# EAGLE schematic TD4SMD2 (EAGLE 9.2.2)
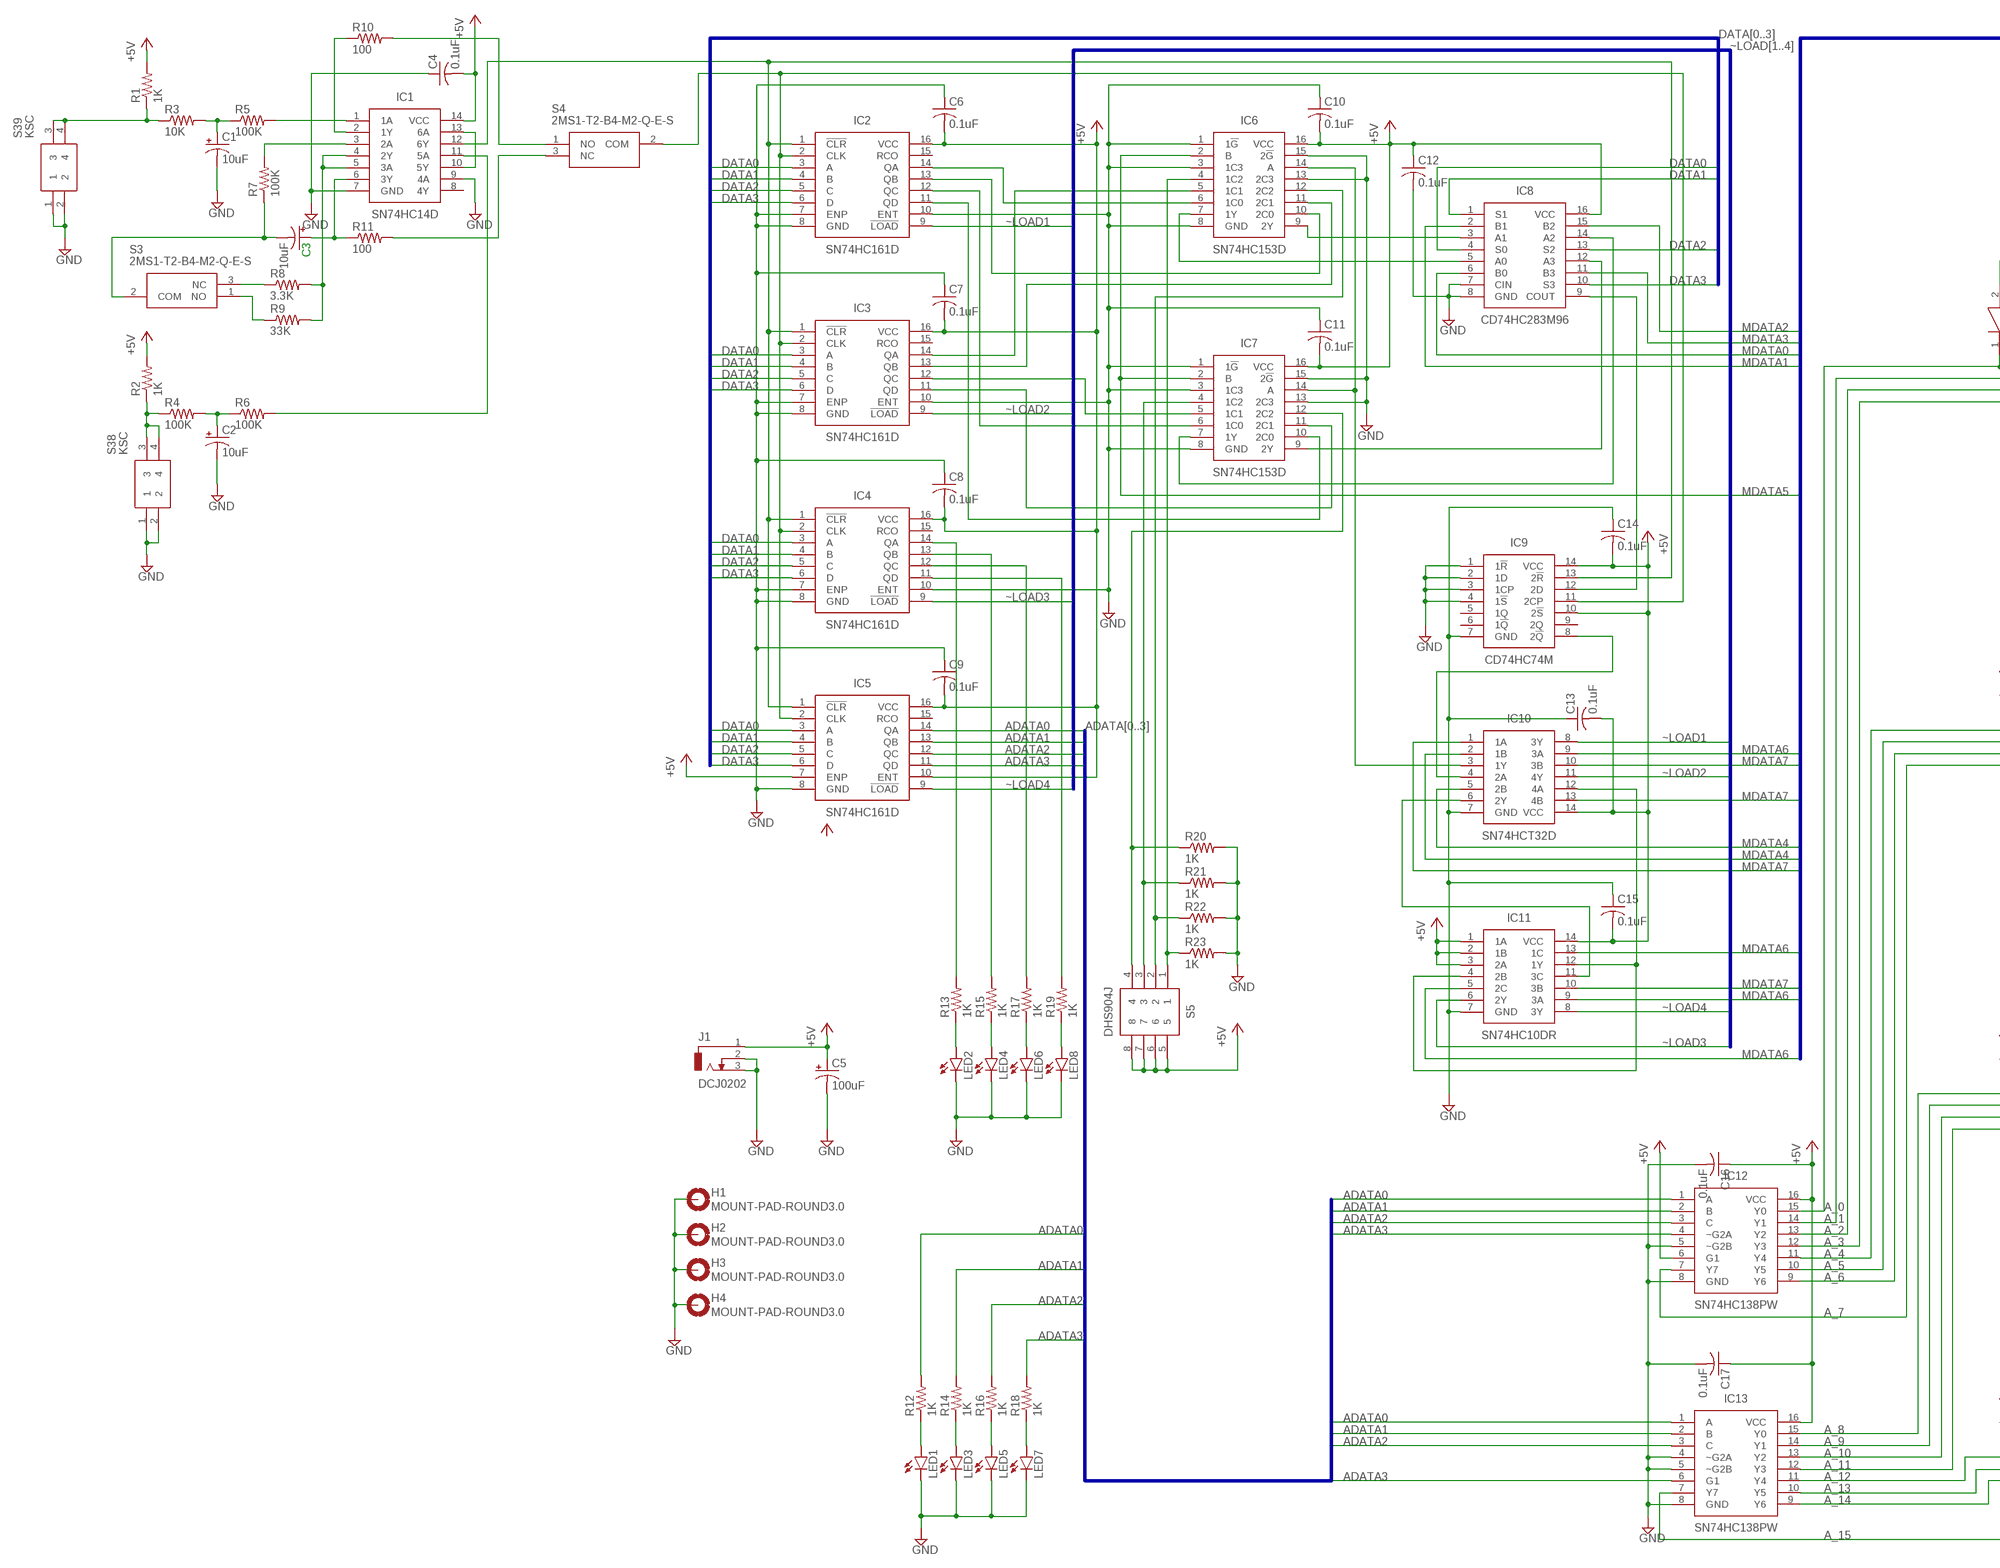
[diagram p0: schematic, sheet 1, part 1 of 2]
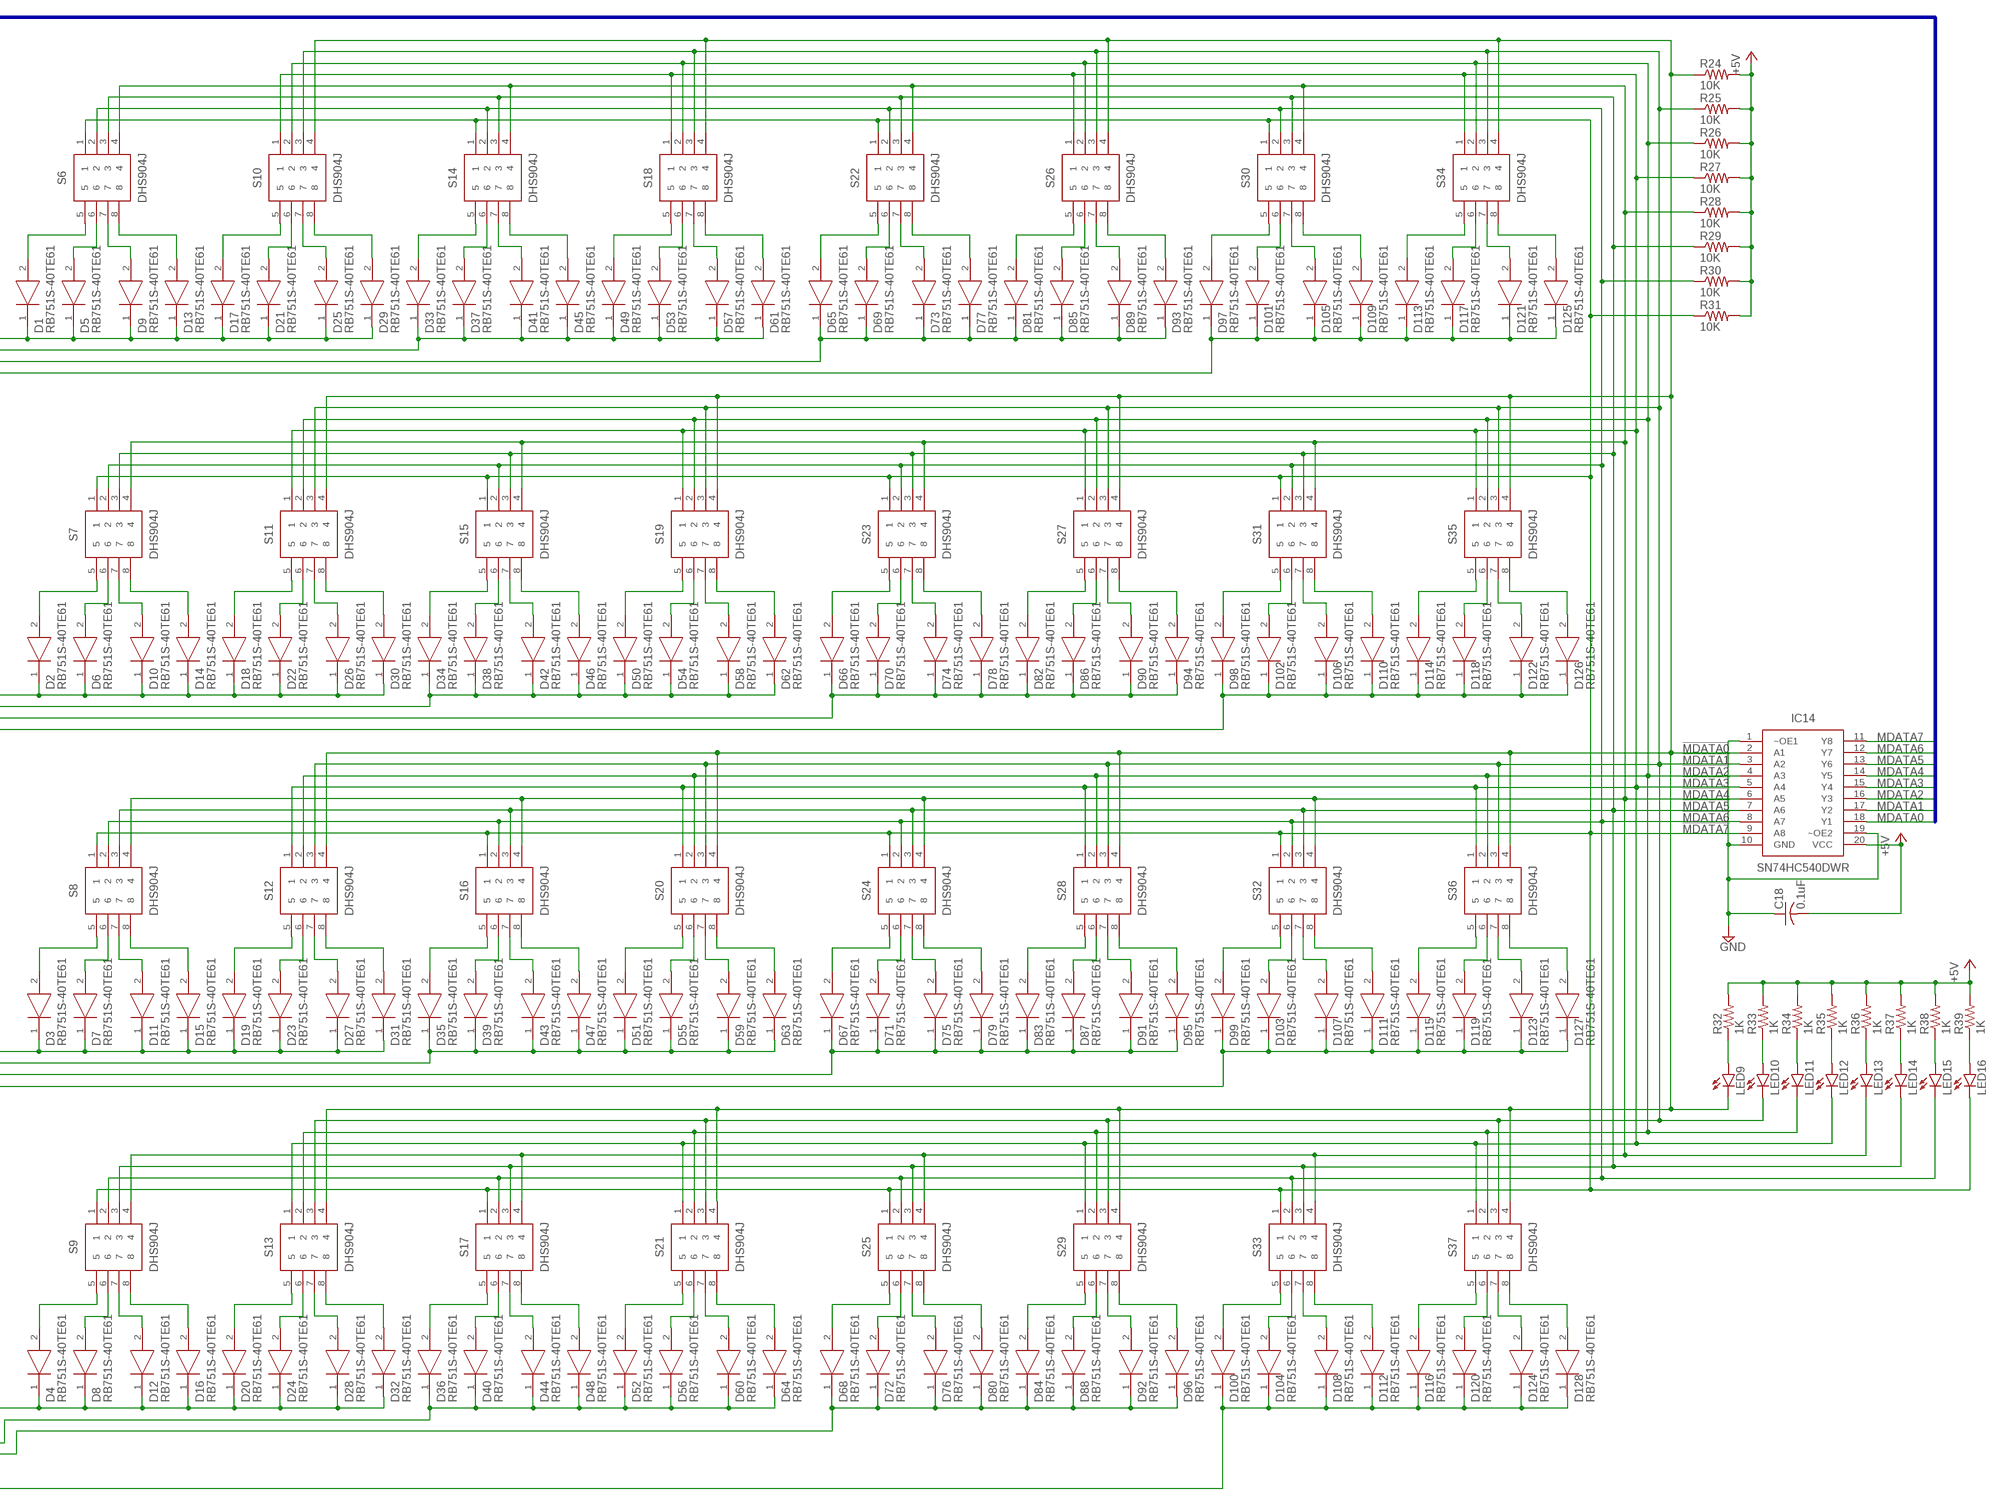
[diagram p1: schematic, sheet 1, part 2 of 2]

## Parts
C1  10uF  CPOL-US153CLV-0405  [153CLV-0405]
C2  10uF  CPOL-US153CLV-0405  [153CLV-0405]
C3  10uF  CPOL-US153CLV-0405  [153CLV-0405]
C4  0.1uF  C-USC0603  [C0603]
C5  100uF  CPOL-US153CLV-1010  [153CLV-1010]
C6  0.1uF  C-USC0603  [C0603]
C7  0.1uF  C-USC0603  [C0603]
C8  0.1uF  C-USC0603  [C0603]
C9  0.1uF  C-USC0603  [C0603]
C10  0.1uF  C-USC0603  [C0603]
C11  0.1uF  C-USC0603  [C0603]
C12  0.1uF  C-USC0603  [C0603]
C13  0.1uF  C-USC0603  [C0603]
C14  0.1uF  C-USC0603  [C0603]
C15  0.1uF  C-USC0603  [C0603]
C16  0.1uF  C-USC0603  [C0603]
C17  0.1uF  C-USC0603  [C0603]
C18  0.1uF  C-USC0603  [C0603]
D1  RB751S-40TE61  [SODFL1608X70N]
D2  RB751S-40TE61  [SODFL1608X70N]
D3  RB751S-40TE61  [SODFL1608X70N]
D4  RB751S-40TE61  [SODFL1608X70N]
D5  RB751S-40TE61  [SODFL1608X70N]
D6  RB751S-40TE61  [SODFL1608X70N]
D7  RB751S-40TE61  [SODFL1608X70N]
D8  RB751S-40TE61  [SODFL1608X70N]
D9  RB751S-40TE61  [SODFL1608X70N]
D10  RB751S-40TE61  [SODFL1608X70N]
D11  RB751S-40TE61  [SODFL1608X70N]
D12  RB751S-40TE61  [SODFL1608X70N]
D13  RB751S-40TE61  [SODFL1608X70N]
D14  RB751S-40TE61  [SODFL1608X70N]
D15  RB751S-40TE61  [SODFL1608X70N]
D16  RB751S-40TE61  [SODFL1608X70N]
D17  RB751S-40TE61  [SODFL1608X70N]
D18  RB751S-40TE61  [SODFL1608X70N]
D19  RB751S-40TE61  [SODFL1608X70N]
D20  RB751S-40TE61  [SODFL1608X70N]
D21  RB751S-40TE61  [SODFL1608X70N]
D22  RB751S-40TE61  [SODFL1608X70N]
D23  RB751S-40TE61  [SODFL1608X70N]
D24  RB751S-40TE61  [SODFL1608X70N]
D25  RB751S-40TE61  [SODFL1608X70N]
D26  RB751S-40TE61  [SODFL1608X70N]
D27  RB751S-40TE61  [SODFL1608X70N]
D28  RB751S-40TE61  [SODFL1608X70N]
D29  RB751S-40TE61  [SODFL1608X70N]
D30  RB751S-40TE61  [SODFL1608X70N]
D31  RB751S-40TE61  [SODFL1608X70N]
D32  RB751S-40TE61  [SODFL1608X70N]
D33  RB751S-40TE61  [SODFL1608X70N]
D34  RB751S-40TE61  [SODFL1608X70N]
D35  RB751S-40TE61  [SODFL1608X70N]
D36  RB751S-40TE61  [SODFL1608X70N]
D37  RB751S-40TE61  [SODFL1608X70N]
D38  RB751S-40TE61  [SODFL1608X70N]
D39  RB751S-40TE61  [SODFL1608X70N]
D40  RB751S-40TE61  [SODFL1608X70N]
D41  RB751S-40TE61  [SODFL1608X70N]
D42  RB751S-40TE61  [SODFL1608X70N]
D43  RB751S-40TE61  [SODFL1608X70N]
D44  RB751S-40TE61  [SODFL1608X70N]
D45  RB751S-40TE61  [SODFL1608X70N]
D46  RB751S-40TE61  [SODFL1608X70N]
D47  RB751S-40TE61  [SODFL1608X70N]
D48  RB751S-40TE61  [SODFL1608X70N]
D49  RB751S-40TE61  [SODFL1608X70N]
D50  RB751S-40TE61  [SODFL1608X70N]
D51  RB751S-40TE61  [SODFL1608X70N]
D52  RB751S-40TE61  [SODFL1608X70N]
D53  RB751S-40TE61  [SODFL1608X70N]
D54  RB751S-40TE61  [SODFL1608X70N]
D55  RB751S-40TE61  [SODFL1608X70N]
D56  RB751S-40TE61  [SODFL1608X70N]
D57  RB751S-40TE61  [SODFL1608X70N]
D58  RB751S-40TE61  [SODFL1608X70N]
D59  RB751S-40TE61  [SODFL1608X70N]
D60  RB751S-40TE61  [SODFL1608X70N]
D61  RB751S-40TE61  [SODFL1608X70N]
D62  RB751S-40TE61  [SODFL1608X70N]
D63  RB751S-40TE61  [SODFL1608X70N]
D64  RB751S-40TE61  [SODFL1608X70N]
D65  RB751S-40TE61  [SODFL1608X70N]
D66  RB751S-40TE61  [SODFL1608X70N]
D67  RB751S-40TE61  [SODFL1608X70N]
D68  RB751S-40TE61  [SODFL1608X70N]
D69  RB751S-40TE61  [SODFL1608X70N]
D70  RB751S-40TE61  [SODFL1608X70N]
D71  RB751S-40TE61  [SODFL1608X70N]
D72  RB751S-40TE61  [SODFL1608X70N]
D73  RB751S-40TE61  [SODFL1608X70N]
D74  RB751S-40TE61  [SODFL1608X70N]
D75  RB751S-40TE61  [SODFL1608X70N]
D76  RB751S-40TE61  [SODFL1608X70N]
D77  RB751S-40TE61  [SODFL1608X70N]
D78  RB751S-40TE61  [SODFL1608X70N]
D79  RB751S-40TE61  [SODFL1608X70N]
D80  RB751S-40TE61  [SODFL1608X70N]
D81  RB751S-40TE61  [SODFL1608X70N]
D82  RB751S-40TE61  [SODFL1608X70N]
D83  RB751S-40TE61  [SODFL1608X70N]
D84  RB751S-40TE61  [SODFL1608X70N]
D85  RB751S-40TE61  [SODFL1608X70N]
D86  RB751S-40TE61  [SODFL1608X70N]
D87  RB751S-40TE61  [SODFL1608X70N]
D88  RB751S-40TE61  [SODFL1608X70N]
D89  RB751S-40TE61  [SODFL1608X70N]
D90  RB751S-40TE61  [SODFL1608X70N]
D91  RB751S-40TE61  [SODFL1608X70N]
D92  RB751S-40TE61  [SODFL1608X70N]
D93  RB751S-40TE61  [SODFL1608X70N]
D94  RB751S-40TE61  [SODFL1608X70N]
D95  RB751S-40TE61  [SODFL1608X70N]
D96  RB751S-40TE61  [SODFL1608X70N]
D97  RB751S-40TE61  [SODFL1608X70N]
D98  RB751S-40TE61  [SODFL1608X70N]
D99  RB751S-40TE61  [SODFL1608X70N]
D100  RB751S-40TE61  [SODFL1608X70N]
D101  RB751S-40TE61  [SODFL1608X70N]
D102  RB751S-40TE61  [SODFL1608X70N]
D103  RB751S-40TE61  [SODFL1608X70N]
D104  RB751S-40TE61  [SODFL1608X70N]
D105  RB751S-40TE61  [SODFL1608X70N]
D106  RB751S-40TE61  [SODFL1608X70N]
D107  RB751S-40TE61  [SODFL1608X70N]
D108  RB751S-40TE61  [SODFL1608X70N]
D109  RB751S-40TE61  [SODFL1608X70N]
D110  RB751S-40TE61  [SODFL1608X70N]
D111  RB751S-40TE61  [SODFL1608X70N]
D112  RB751S-40TE61  [SODFL1608X70N]
D113  RB751S-40TE61  [SODFL1608X70N]
D114  RB751S-40TE61  [SODFL1608X70N]
D115  RB751S-40TE61  [SODFL1608X70N]
D116  RB751S-40TE61  [SODFL1608X70N]
D117  RB751S-40TE61  [SODFL1608X70N]
D118  RB751S-40TE61  [SODFL1608X70N]
D119  RB751S-40TE61  [SODFL1608X70N]
D120  RB751S-40TE61  [SODFL1608X70N]
D121  RB751S-40TE61  [SODFL1608X70N]
D122  RB751S-40TE61  [SODFL1608X70N]
D123  RB751S-40TE61  [SODFL1608X70N]
D124  RB751S-40TE61  [SODFL1608X70N]
D125  RB751S-40TE61  [SODFL1608X70N]
D126  RB751S-40TE61  [SODFL1608X70N]
D127  RB751S-40TE61  [SODFL1608X70N]
D128  RB751S-40TE61  [SODFL1608X70N]
H1  MOUNT-PAD-ROUND3.0  [3,0-PAD]
H2  MOUNT-PAD-ROUND3.0  [3,0-PAD]
H3  MOUNT-PAD-ROUND3.0  [3,0-PAD]
H4  MOUNT-PAD-ROUND3.0  [3,0-PAD]
IC1  SN74HC14D  [SOIC127P600X175-14N]
IC2  SN74HC161D  [SOIC127P600X175-16N]
IC3  SN74HC161D  [SOIC127P600X175-16N]
IC4  SN74HC161D  [SOIC127P600X175-16N]
IC5  SN74HC161D  [SOIC127P600X175-16N]
IC6  SN74HC153D  [SOIC127P600X175-16N]
IC7  SN74HC153D  [SOIC127P600X175-16N]
IC8  CD74HC283M96  [SOIC127P600X175-16N]
IC9  CD74HC74M  [SOIC127P600X175-14N]
IC10  SN74HCT32D  [SOIC127P600X175-14N]
IC11  SN74HC10DR  [SOIC127P600X175-14N]
IC12  SN74HC138PW  [SOP65P640X120-16N]
IC13  SN74HC138PW  [SOP65P640X120-16N]
IC14  SN74HC540DWR  [SOIC127P1030X265-20N]
J1  DCJ0202  [DCJ0202]
LED1  LEDCHIP-LED0603  [CHIP-LED0603]
LED2  LEDCHIP-LED0603  [CHIP-LED0603]
LED3  LEDCHIP-LED0603  [CHIP-LED0603]
LED4  LEDCHIP-LED0603  [CHIP-LED0603]
LED5  LEDCHIP-LED0603  [CHIP-LED0603]
LED6  LEDCHIP-LED0603  [CHIP-LED0603]
LED7  LEDCHIP-LED0603  [CHIP-LED0603]
LED8  LEDCHIP-LED0603  [CHIP-LED0603]
LED9  LEDCHIP-LED0603  [CHIP-LED0603]
LED10  LEDCHIP-LED0603  [CHIP-LED0603]
LED11  LEDCHIP-LED0603  [CHIP-LED0603]
LED12  LEDCHIP-LED0603  [CHIP-LED0603]
LED13  LEDCHIP-LED0603  [CHIP-LED0603]
LED14  LEDCHIP-LED0603  [CHIP-LED0603]
LED15  LEDCHIP-LED0603  [CHIP-LED0603]
LED16  LEDCHIP-LED0603  [CHIP-LED0603]
R1  1K  R-US_R0603  [R0603]
R2  1K  R-US_R0603  [R0603]
R3  10K  R-US_R0603  [R0603]
R4  100K  R-US_R0603  [R0603]
R5  100K  R-US_R0603  [R0603]
R6  100K  R-US_R0603  [R0603]
R7  100K  R-US_R0603  [R0603]
R8  3.3K  R-US_R0603  [R0603]
R9  33K  R-US_R0603  [R0603]
R10  100  R-US_R0603  [R0603]
R11  100  R-US_R0603  [R0603]
R12  1K  R-US_R0603  [R0603]
R13  1K  R-US_R0603  [R0603]
R14  1K  R-US_R0603  [R0603]
R15  1K  R-US_R0603  [R0603]
R16  1K  R-US_R0603  [R0603]
R17  1K  R-US_R0603  [R0603]
R18  1K  R-US_R0603  [R0603]
R19  1K  R-US_R0603  [R0603]
R20  1K  R-US_R0603  [R0603]
R21  1K  R-US_R0603  [R0603]
R22  1K  R-US_R0603  [R0603]
R23  1K  R-US_R0603  [R0603]
R24  10K  R-US_R0603  [R0603]
R25  10K  R-US_R0603  [R0603]
R26  10K  R-US_R0603  [R0603]
R27  10K  R-US_R0603  [R0603]
R28  10K  R-US_R0603  [R0603]
R29  10K  R-US_R0603  [R0603]
R30  10K  R-US_R0603  [R0603]
R31  10K  R-US_R0603  [R0603]
R32  1K  R-US_R0603  [R0603]
R33  1K  R-US_R0603  [R0603]
R34  1K  R-US_R0603  [R0603]
R35  1K  R-US_R0603  [R0603]
R36  1K  R-US_R0603  [R0603]
R37  1K  R-US_R0603  [R0603]
R38  1K  R-US_R0603  [R0603]
R39  1K  R-US_R0603  [R0603]
S3  2MS1-T2-B4-M2-Q-E-S  [2MS1T2B4M2QES]
S4  2MS1-T2-B4-M2-Q-E-S  [2MS1T2B4M2QES]
S5  DHS904J  [DHS904J]
S6  DHS904J  [DHS904J]
S7  DHS904J  [DHS904J]
S8  DHS904J  [DHS904J]
S9  DHS904J  [DHS904J]
S10  DHS904J  [DHS904J]
S11  DHS904J  [DHS904J]
S12  DHS904J  [DHS904J]
S13  DHS904J  [DHS904J]
S14  DHS904J  [DHS904J]
S15  DHS904J  [DHS904J]
S16  DHS904J  [DHS904J]
S17  DHS904J  [DHS904J]
S18  DHS904J  [DHS904J]
S19  DHS904J  [DHS904J]
S20  DHS904J  [DHS904J]
S21  DHS904J  [DHS904J]
S22  DHS904J  [DHS904J]
S23  DHS904J  [DHS904J]
S24  DHS904J  [DHS904J]
S25  DHS904J  [DHS904J]
S26  DHS904J  [DHS904J]
S27  DHS904J  [DHS904J]
S28  DHS904J  [DHS904J]
S29  DHS904J  [DHS904J]
S30  DHS904J  [DHS904J]
S31  DHS904J  [DHS904J]
S32  DHS904J  [DHS904J]
S33  DHS904J  [DHS904J]
S34  DHS904J  [DHS904J]
S35  DHS904J  [DHS904J]
S36  DHS904J  [DHS904J]
S37  DHS904J  [DHS904J]
S38  KSC  [KSC]
S39  KSC  [KSC]

## Nets
!MDATA0: IC14.2(A1) LED9.C R24.1 S10.4 S11.4 S12.4 S13.4 S18.4 S19.4 S20.4 S21.4 S26.4 S27.4 S28.4 S29.4 S34.4 S35.4 S36.4 S37.4
!MDATA1: IC14.3(A2) LED10.C R25.1 S10.3 S11.3 S12.3 S13.3 S18.3 S19.3 S20.3 S21.3 S26.3 S27.3 S28.3 S29.3 S34.3 S35.3 S36.3 S37.3
!MDATA2: IC14.4(A3) LED11.C R26.1 S10.2 S11.2 S12.2 S13.2 S18.2 S19.2 S20.2 S21.2 S26.2 S27.2 S28.2 S29.2 S34.2 S35.2 S36.2 S37.2
!MDATA3: IC14.5(A4) LED12.C R27.1 S10.1 S11.1 S12.1 S13.1 S18.1 S19.1 S20.1 S21.1 S26.1 S27.1 S28.1 S29.1 S34.1 S35.1 S36.1 S37.1
!MDATA4: IC14.6(A5) LED13.C R28.1 S6.4 S7.4 S8.4 S9.4 S14.4 S15.4 S16.4 S17.4 S22.4 S23.4 S24.4 S25.4 S30.4 S31.4 S32.4 S33.4
!MDATA5: IC14.7(A6) LED14.C R29.1 S6.3 S7.3 S8.3 S9.3 S14.3 S15.3 S16.3 S17.3 S22.3 S23.3 S24.3 S25.3 S30.3 S31.3 S32.3 S33.3
!MDATA6: IC14.8(A7) LED15.C R30.1 S6.2 S7.2 S8.2 S9.2 S14.2 S15.2 S16.2 S17.2 S22.2 S23.2 S24.2 S25.2 S30.2 S31.2 S32.2 S33.2
!MDATA7: IC14.9(A8) LED16.C R31.1 S6.1 S7.1 S8.1 S9.1 S14.1 S15.1 S16.1 S17.1 S22.1 S23.1 S24.1 S25.1 S30.1 S31.1 S32.1 S33.1
+5V [Power]: C4.2 C5.+ C6.2 C7.2 C8.2 C9.2 C10.2 C11.2 C12.1 C13.2 C14.2 C15.2 C16.1 C17.1 C18.2 IC1.14(VCC) IC2.16(VCC) IC3.16(VCC) IC4.16(VCC) IC5.7(ENP) IC5.10(ENT) IC5.16(VCC) IC6.16(VCC) IC7.16(VCC) IC8.16(VCC) IC9.10(2!S) IC9.14(VCC) IC10.14(VCC) IC11.1(1A) IC11.2(1B) IC11.3(2A) IC11.14(VCC) IC12.6(G1) IC12.16(VCC) IC13.16(VCC) IC14.20(VCC) J1.1 R1.2 R2.2 R24.2 R25.2 R26.2 R27.2 R28.2 R29.2 R30.2 R31.2 R32.2 R33.2 R34.2 R35.2 R36.2 R37.2 R38.2 R39.2 S5.5 S5.6 S5.7 S5.8
A_0: D1.1(K) D5.1(K) D9.1(K) D13.1(K) D17.1(K) D21.1(K) D25.1(K) D29.1(K) IC12.15(Y0)
A_1: D33.1(K) D37.1(K) D41.1(K) D45.1(K) D49.1(K) D53.1(K) D57.1(K) D61.1(K) IC12.14(Y1)
A_2: D65.1(K) D69.1(K) D73.1(K) D77.1(K) D81.1(K) D85.1(K) D89.1(K) D93.1(K) IC12.13(Y2)
A_3: D97.1(K) D101.1(K) D105.1(K) D109.1(K) D113.1(K) D117.1(K) D121.1(K) D125.1(K) IC12.12(Y3)
A_4: D2.1(K) D6.1(K) D10.1(K) D14.1(K) D18.1(K) D22.1(K) D26.1(K) D30.1(K) IC12.11(Y4)
A_5: D34.1(K) D38.1(K) D42.1(K) D46.1(K) D50.1(K) D54.1(K) D58.1(K) D62.1(K) IC12.10(Y5)
A_6: D66.1(K) D70.1(K) D74.1(K) D78.1(K) D82.1(K) D86.1(K) D90.1(K) D94.1(K) IC12.9(Y6)
A_7: D98.1(K) D102.1(K) D106.1(K) D110.1(K) D114.1(K) D118.1(K) D122.1(K) D126.1(K) IC12.7(Y7)
A_8: D3.1(K) D7.1(K) D11.1(K) D15.1(K) D19.1(K) D23.1(K) D27.1(K) D31.1(K) IC13.15(Y0)
A_9: D35.1(K) D39.1(K) D43.1(K) D47.1(K) D51.1(K) D55.1(K) D59.1(K) D63.1(K) IC13.14(Y1)
A_10: D67.1(K) D71.1(K) D75.1(K) D79.1(K) D83.1(K) D87.1(K) D91.1(K) D95.1(K) IC13.13(Y2)
A_11: D99.1(K) D103.1(K) D107.1(K) D111.1(K) D115.1(K) D119.1(K) D123.1(K) D127.1(K) IC13.12(Y3)
A_12: D4.1(K) D8.1(K) D12.1(K) D16.1(K) D20.1(K) D24.1(K) D28.1(K) D32.1(K) IC13.11(Y4)
A_13: D36.1(K) D40.1(K) D44.1(K) D48.1(K) D52.1(K) D56.1(K) D60.1(K) D64.1(K) IC13.10(Y5)
A_14: D68.1(K) D72.1(K) D76.1(K) D80.1(K) D84.1(K) D88.1(K) D92.1(K) D96.1(K) IC13.9(Y6)
A_15: D100.1(K) D104.1(K) D108.1(K) D112.1(K) D116.1(K) D120.1(K) D124.1(K) D128.1(K) IC13.7(Y7)
ADATA0: IC5.14(QA) IC12.1(A) IC13.1(A) R12.2
ADATA1: IC5.13(QB) IC12.2(B) IC13.2(B) R14.2
ADATA2: IC5.12(QC) IC12.3(C) IC13.3(C) R16.2
ADATA3: IC5.11(QD) IC12.4(~G2A) IC13.6(G1) R18.2
DATA0: IC2.3(A) IC3.3(A) IC4.3(A) IC5.3(A) IC8.4(S0)
DATA1: IC2.4(B) IC3.4(B) IC4.4(B) IC5.4(B) IC8.1(S1)
DATA2: IC2.5(C) IC3.5(C) IC4.5(C) IC5.5(C) IC8.13(S2)
DATA3: IC2.6(D) IC3.6(D) IC4.6(D) IC5.6(D) IC8.10(S3)
GND [Power]: C1.- C2.- C4.1 C5.- C6.1 C7.1 C8.1 C9.1 C10.1 C11.1 C12.2 C13.1 C14.1 C15.1 C16.2 C17.2 C18.1 H1.B3,0(MOUNT) H2.B3,0(MOUNT) H3.B3,0(MOUNT) H4.B3,0(MOUNT) IC1.7(GND) IC1.9(4A) IC2.7(ENP) IC2.8(GND) IC2.10(ENT) IC3.7(ENP) IC3.8(GND) IC3.10(ENT) IC4.7(ENP) IC4.8(GND) IC4.10(ENT) IC5.8(GND) IC6.1(1!G) IC6.3(1C3) IC6.8(GND) IC6.13(2C3) IC6.15(2!G) IC7.1(1!G) IC7.3(1C3) IC7.8(GND) IC7.13(2C3) IC7.15(2!G) IC8.7(CIN) IC8.8(GND) IC9.1(1!R) IC9.2(1D) IC9.3(1CP) IC9.4(1!S) IC9.7(GND) IC10.7(GND) IC11.7(GND) IC12.5(~G2B) IC12.8(GND) IC13.4(~G2A) IC13.5(~G2B) IC13.8(GND) IC14.1(~OE1) IC14.10(GND) IC14.19(~OE2) J1.2 J1.3 LED1.C LED2.C LED3.C LED4.C LED5.C LED6.C LED7.C LED8.C R20.2 R21.2 R22.2 R23.2 S38.1 S38.2 S39.1 S39.2
MDATA0: IC8.6(B0) IC14.18(Y1)
MDATA1: IC8.2(B1) IC14.17(Y2)
MDATA2: IC8.15(B2) IC14.16(Y3)
MDATA3: IC8.11(B3) IC14.15(Y4)
MDATA4: IC10.2(1B) IC10.5(2B) IC14.14(Y5)
MDATA5: IC6.2(B) IC7.2(B) IC14.13(Y6)
MDATA6: IC10.9(3A) IC11.5(2C) IC11.9(3A) IC11.13(1C) IC14.12(Y7)
MDATA7: IC10.1(1A) IC10.10(3B) IC10.13(4B) IC11.10(3B) IC14.11(Y8)
N$1: IC2.14(QA) IC6.6(1C0)
N$2: IC2.13(QB) IC6.10(2C0)
N$3: IC2.12(QC) IC7.6(1C0)
N$4: IC7.7(1Y) IC8.14(A2)
N$5: IC6.4(1C2) R23.1 S5.1
N$6: IC6.12(2C2) R22.1 S5.2
N$7: IC7.4(1C2) R21.1 S5.3
N$8: IC7.12(2C2) R20.1 S5.4
N$9: R1.1 R3.1 S39.3 S39.4
N$10: IC3.14(QA) IC6.5(1C1)
N$11: IC3.13(QB) IC6.11(2C1)
N$12: IC3.11(QD) IC7.11(2C1)
N$13: IC3.12(QC) IC7.5(1C1)
N$14: IC4.14(QA) R13.2
N$15: IC4.13(QB) R15.2
N$16: IC4.12(QC) R17.2
N$17: IC4.11(QD) R19.2
N$18: LED2.A R13.1
N$19: LED4.A R15.1
N$20: LED6.A R17.1
N$21: LED8.A R19.1
N$22: IC2.11(QD) IC7.10(2C0)
N$23: IC6.7(1Y) IC8.5(A0)
N$24: IC1.12(6Y) IC2.1(!CLR) IC3.1(!CLR) IC4.1(!CLR) IC5.1(!CLR) IC9.13(2!R)
N$25: IC2.2(CLK) IC3.2(CLK) IC4.2(CLK) IC5.2(CLK) IC9.11(2CP) S4.2(COM)
N$26: IC6.9(2Y) IC8.3(A1)
N$27: IC10.12(4A) IC11.4(2B) IC11.12(1Y)
N$28: IC7.9(2Y) IC8.12(A3)
N$29: IC6.14(A) IC7.14(A) IC10.3(1Y)
N$30: LED9.A R32.1
N$31: IC9.8(2!Q) IC10.4(2A)
N$32: IC10.6(2Y) IC11.11(3C)
N$33: IC8.9(COUT) IC9.12(2D)
N$34: D125.2(A) S34.8
N$35: D121.2(A) S34.7
N$36: IC1.2(1Y) R10.1
N$37: R10.2 S4.1(NO)
N$38: C1.+ R3.2 R5.1
N$39: IC1.1(1A) R5.2
N$40: R11.2 S4.3(NC)
N$41: C3.+ IC1.6(3Y) R11.1
N$42: C3.- R7.1 S3.2(COM)
N$43: IC1.3(2A) R7.2
N$44: IC1.4(2Y) IC1.5(3A) R8.2 R9.2
N$45: R8.1 S3.3(NC)
N$46: R9.1 S3.1(NO)
N$47: IC1.10(5Y) IC1.13(6A)
N$48: IC1.11(5A) R6.2
N$49: R2.1 R4.1 S38.3 S38.4
N$50: C2.+ R4.2 R6.1
N$51: D117.2(A) S34.6
N$52: D113.2(A) S34.5
N$53: D109.2(A) S30.8
N$54: D105.2(A) S30.7
N$55: D101.2(A) S30.6
N$56: D97.2(A) S30.5
N$57: D93.2(A) S26.8
N$58: D89.2(A) S26.7
N$59: D85.2(A) S26.6
N$60: D81.2(A) S26.5
N$61: D77.2(A) S22.8
N$62: D73.2(A) S22.7
N$63: D69.2(A) S22.6
N$64: D65.2(A) S22.5
N$65: D127.2(A) S36.8
N$66: D61.2(A) S18.8
N$67: D57.2(A) S18.7
N$68: D53.2(A) S18.6
N$69: D49.2(A) S18.5
N$70: D45.2(A) S14.8
N$71: D41.2(A) S14.7
N$72: D37.2(A) S14.6
N$73: D33.2(A) S14.5
N$74: D29.2(A) S10.8
N$75: D25.2(A) S10.7
N$76: D21.2(A) S10.6
N$77: D17.2(A) S10.5
N$78: D13.2(A) S6.8
N$79: D9.2(A) S6.7
N$80: D5.2(A) S6.6
N$81: D1.2(A) S6.5
N$82: D126.2(A) S35.8
N$83: D122.2(A) S35.7
N$84: D118.2(A) S35.6
N$85: D114.2(A) S35.5
N$86: D110.2(A) S31.8
N$87: D106.2(A) S31.7
N$88: D102.2(A) S31.6
N$89: D98.2(A) S31.5
N$90: D94.2(A) S27.8
N$91: D90.2(A) S27.7
N$92: D86.2(A) S27.6
N$93: D82.2(A) S27.5
N$94: D78.2(A) S23.8
N$95: D74.2(A) S23.7
N$96: D70.2(A) S23.6
N$97: D66.2(A) S23.5
N$98: D62.2(A) S19.8
N$99: D58.2(A) S19.7
N$100: D54.2(A) S19.6
N$101: D50.2(A) S19.5
N$102: D46.2(A) S15.8
N$103: D42.2(A) S15.7
N$104: D38.2(A) S15.6
N$105: D34.2(A) S15.5
N$106: D30.2(A) S11.8
N$107: D26.2(A) S11.7
N$108: D22.2(A) S11.6
N$109: D18.2(A) S11.5
N$110: D14.2(A) S7.8
N$111: D10.2(A) S7.7
N$112: D6.2(A) S7.6
N$113: D2.2(A) S7.5
N$114: D123.2(A) S36.7
N$115: D119.2(A) S36.6
N$116: D115.2(A) S36.5
N$117: D111.2(A) S32.8
N$118: D107.2(A) S32.7
N$119: D103.2(A) S32.6
N$120: D99.2(A) S32.5
N$121: D95.2(A) S28.8
N$122: D91.2(A) S28.7
N$123: D87.2(A) S28.6
N$124: D83.2(A) S28.5
N$125: D79.2(A) S24.8
N$126: D75.2(A) S24.7
N$127: D71.2(A) S24.6
N$128: D67.2(A) S24.5
N$129: D63.2(A) S20.8
N$130: D59.2(A) S20.7
N$131: D55.2(A) S20.6
N$132: D51.2(A) S20.5
N$133: D47.2(A) S16.8
N$134: D43.2(A) S16.7
N$135: D39.2(A) S16.6
N$136: D35.2(A) S16.5
N$137: D31.2(A) S12.8
N$138: D27.2(A) S12.7
N$139: D23.2(A) S12.6
N$140: D19.2(A) S12.5
N$141: D15.2(A) S8.8
N$142: D11.2(A) S8.7
N$143: D7.2(A) S8.6
N$144: D3.2(A) S8.5
N$145: D128.2(A) S37.8
N$146: D124.2(A) S37.7
N$147: D120.2(A) S37.6
N$148: D116.2(A) S37.5
N$149: D112.2(A) S33.8
N$150: D108.2(A) S33.7
N$151: D104.2(A) S33.6
N$152: D100.2(A) S33.5
N$153: D96.2(A) S29.8
N$154: D92.2(A) S29.7
N$155: D88.2(A) S29.6
N$156: D84.2(A) S29.5
N$157: D80.2(A) S25.8
N$158: D76.2(A) S25.7
N$159: D72.2(A) S25.6
N$160: D68.2(A) S25.5
N$161: D64.2(A) S21.8
N$162: D60.2(A) S21.7
N$163: D56.2(A) S21.6
N$164: D52.2(A) S21.5
N$165: D48.2(A) S17.8
N$166: D44.2(A) S17.7
N$167: D40.2(A) S17.6
N$168: D36.2(A) S17.5
N$169: D32.2(A) S13.8
N$170: D28.2(A) S13.7
N$171: D24.2(A) S13.6
N$172: D20.2(A) S13.5
N$173: D16.2(A) S9.8
N$174: D12.2(A) S9.7
N$175: D8.2(A) S9.6
N$176: D4.2(A) S9.5
N$177: LED10.A R33.1
N$178: LED12.A R35.1
N$179: LED11.A R34.1
N$180: LED1.A R12.1
N$181: LED3.A R14.1
N$182: LED5.A R16.1
N$183: LED7.A R18.1
N$184: LED13.A R36.1
N$185: LED14.A R37.1
N$186: LED15.A R38.1
N$187: LED16.A R39.1
~LOAD1: IC2.9(!LOAD) IC10.8(3Y)
~LOAD2: IC3.9(!LOAD) IC10.11(4Y)
~LOAD3: IC4.9(!LOAD) IC11.6(2Y)
~LOAD4: IC5.9(!LOAD) IC11.8(3Y)
Unconnected: IC1.8(4Y) IC2.15(RCO) IC3.15(RCO) IC4.15(RCO) IC5.15(RCO) IC9.5(1Q) IC9.6(1!Q) IC9.9(2Q)

## Buses
DATA[0..3]
~LOAD[1..4]
ADATA[0..3]
MDATA[0..7]

## Library data of the parts
C1-C3 C5 = rcl:CPOL-US: POLARIZED CAPACITOR, American symbol; SPICEPREFIX: C
C4 C6-C18 = rcl:C-US: CAPACITOR, American symbol; SPICEPREFIX: C
D1-D128 = RB751S-40TE61:RB751S-40TE61: Schottky Diodes & Rectifiers SCHOTTKY 40V 30MA Source: Datasheet <https://componentsearchengine.com/Datasheets/1/RB751S-40TE61.pdf>; ALLIED_NUMBER: 70666541; ALLIED_PRICE-STOCK: https://www.alliedelec.com/rohm-semiconductor-rb751s-40te61/70666541/; ARROW_PART_NUMBER: RB751S-40TE61; ARROW_PRICE-STOCK: http://uk.rs-online.com/web/p/products/6942884; DESCRIPTION: Schottky Diodes & Rectifiers SCHOTTKY 40V 30MA; HEIGHT: 0.7mm; MANUFACTURER_NAME: ROHM Semiconductor; MANUFACTURER_PART_NUMBER: RB751S-40TE61; RS_PART_NUMBER: 6942884; RS_PRICE-STOCK: http://uk.rs-online.com/web/p/products/6942884
H1-H4 = holes:MOUNT-PAD-ROUND: MOUNTING PAD, round
IC1 = SamacSys_Parts:SN74HC14D: SN74HC14D, Hex Schmitt Trigger Inverter, HC, 5.2mA 2 to 6V 14-Pin SOIC <https://componentsearchengine.com/Images/3/SN74HC14D.gif> Source: Datasheet <http://www.ti.com/lit/ds/symlink/sn74hc14.pdf>; DESCRIPTION: SN74HC14D, Hex Schmitt Trigger Inverter, HC, 5.2mA 2 to 6V 14-Pin SOIC; HEIGHT: 1.75mm; MANUFACTURER_NAME: Texas Instruments; MANUFACTURER_PART_NUMBER: SN74HC14D; RS_PART_NUMBER: 4368423; SUPPLIER_NAME: RS
IC2-IC5 = SamacSys_Parts:SN74HC161D: SN74HC161D <https://componentsearchengine.com/Images/3/SN74HC161D.gif> Source: Datasheet <http://www.ti.com/lit/ds/symlink/sn74hc161.pdf>; DESCRIPTION: SN74HC161D; HEIGHT: 1.75mm; MANUFACTURER_NAME: Texas Instruments; MANUFACTURER_PART_NUMBER: SN74HC161D; RS_PART_NUMBER: 6631969; SUPPLIER_NAME: RS
IC6 IC7 = SamacSys_Parts:SN74HC153D: SN74HC153D, Multiplexer Dual 4:1, 16-Pin, SOIC <https://componentsearchengine.com/Images/3/SN74HC153D.gif> Source: Datasheet <http://www.ti.com/lit/ds/symlink/sn74hc153.pdf>; DESCRIPTION: SN74HC153D, Multiplexer Dual 4:1, 16-Pin, SOIC; HEIGHT: 1.75mm; MANUFACTURER_NAME: Texas Instruments; MANUFACTURER_PART_NUMBER: SN74HC153D; RS_PART_NUMBER: 6631944; SUPPLIER_NAME: RS
IC8 = CD74HC283M96:CD74HC283M96: Texas Instruments CD74HC283M96, 4-Bit Binary Full Adder, 2 6 V, 16-Pin SOIC Source: Datasheet <http://www.ti.com/lit/gpn/cd74hc283>; ARROW_PART_NUMBER: CD74HC283M96; ARROW_PRICE-STOCK: https://www.arrow.com/en/products/cd74hc283m96/texas-instruments; DESCRIPTION: Texas Instruments CD74HC283M96, 4-Bit Binary Full Adder, 2 6 V, 16-Pin SOIC; HEIGHT: 1.75mm; MANUFACTURER_NAME: Texas Instruments; MANUFACTURER_PART_NUMBER: CD74HC283M96; RS_PART_NUMBER: 1457149; RS_PRICE-STOCK: http://uk.rs-online.com/web/p/products/1457149
IC9 = SamacSys_Parts:CD74HC74M: CD74HC74M, Dual D Type Flip Flop HC, 2 to 6V 14-Pin SOIC <https://componentsearchengine.com/Images/3/CD74HC74M.jpg> Source: Datasheet <http://docs-europe.electrocomponents.com/webdocs/0b76/0900766b80b764b0.pdf>; DESCRIPTION: CD74HC74M, Dual D Type Flip Flop HC, 2 to 6V 14-Pin SOIC; HEIGHT: 1.75mm; MANUFACTURER_NAME: Texas Instruments; MANUFACTURER_PART_NUMBER: CD74HC74M; RS_PART_NUMBER: 0527675; SUPPLIER_NAME: RS
IC10 = SamacSys_Parts:SN74HCT32D: Texas Instruments SN74HCT32D, Quad 2-Input OR Logic Gate, 4.5 5.5 V, 14-Pin SOIC <http://uk.rs-online.com/largeimages/W0526167-01.jpg> Source: Datasheet; DESCRIPTION: Texas Instruments SN74HCT32D, Quad 2-Input OR Logic Gate, 4.5 5.5 V, 14-Pin SOIC; HEIGHT: mm; MANUFACTURER_NAME: Texas Instruments; MANUFACTURER_PART_NUMBER: SN74HCT32D; RS_PART_NUMBER: 0526167; SUPPLIER_NAME: RS
IC11 = SamacSys_Parts:SN74HC10DR: SN74HC10DR, Logic Gate Triple 3 Input NAND, HC, 5.2mA 2 ??? 6 V 14-Pin SOIC <https://componentsearchengine.com/Images/3/SN74HC10DR.jpg> Source: Datasheet <http://www.ti.com/lit/ds/symlink/sn74hc10.pdf>; DESCRIPTION: SN74HC10DR, Logic Gate Triple 3 Input NAND, HC, 5.2mA 2 ??? 6 V 14-Pin SOIC; HEIGHT: 1.75mm; MANUFACTURER_NAME: Texas Instruments; MANUFACTURER_PART_NUMBER: SN74HC10DR; RS_PART_NUMBER: 6628089; SUPPLIER_NAME: RS
IC12 IC13 = SamacSys_Parts:SN74HC138PW: Texas Instruments SN74HC138PW, Decoder, Demultiplexer, 1-of-8, Inverting, 2 6 V, 16-Pin TSSOP <https://componentsearchengine.com/Images/3/SN74HC138PW.jpg> Source: Datasheet; DESCRIPTION: Texas Instruments SN74HC138PW, Decoder, Demultiplexer, 1-of-8, Inverting, 2 6 V, 16-Pin TSSOP; HEIGHT: mm; MANUFACTURER_NAME: Texas Instruments; MANUFACTURER_PART_NUMBER: SN74HC138PW; RS_PART_NUMBER: 6631928; SUPPLIER_NAME: RS
IC14 = SamacSys_Parts:SN74HC540DWR: OCTAL BUFFERS AND LINE DRIVERS WITH 3 STATE OUTPUTS Source: Datasheet; DESCRIPTION: OCTAL BUFFERS AND LINE DRIVERS WITH 3 STATE OUTPUTS; HEIGHT: mm; MANUFACTURER_NAME: Texas Instruments; MANUFACTURER_PART_NUMBER: SN74HC540DWR
J1 = con-jack:DCJ0202: DC POWER JACK Source: DCJ0202.pdf; OC_FARNELL: unknown; OC_NEWARK: unknown
LED1-LED16 = led:LED: LED OSRAM: - CHIPLED LG R971, LG N971, LY N971, LG Q971, LY Q971, LO R971, LY R971 LH N974, LH R974 LS Q976, LO Q976, LY Q976 LO Q996 - Hyper CHIPLED LW Q18S LB Q993, LB Q99A, LB R99A - SideLED LS A670, LO A670, LY A670, LG A670, LP A670 LB A673, LV A673, LT A673, LW A673 LH A674 LY A675 LS A676, LA A676, LO A676, LY A676, LW A676 LS A679, LY A679, LG A679 - Hyper Micro SIDELED® LS Y876, LA Y876, LO Y876, LY Y876 LT Y87S - SmartLED LW L88C, LW L88S LB L89C, LB L89S, LG L890 LS L89K, LO L89K, LY L89K LS L896, LA L896, LO L896, LY L896 - TOPLED LS T670, LO T670, LY T670, LG T670, LP T670 LSG T670, LSP T670, LSY T670, LOP T670, LYG T670 LG T671, LOG T671, LSG T671 LB T673, LV T673, LT T673, LW T673 LH T674 LS T676, LA T676, LO T676, LY T676, LB T676, LH T676, LSB T676, LW T676 LB T67C, LV T67C, LT T67C, LS T67K, LO T67K, LY T67K, LW E67C LS E67B, LA E67B, LO E67B, LY E67B, LB E67C, LV E67C, LT E67C LW T67C LS T679, LY T679, LG T679 LS T770, LO T770, LY T770, LG T770, LP T770 LB T773, LV T773, LT T773, LW T773 LH T774 LS E675, LA E675, LY E675, LS T675 LS T776, LA T776, LO T776, LY T776, LB T776 LHGB T686 LT T68C, LB T68C - Hyper Mini TOPLED® LB M676 - Mini TOPLED Santana® LG M470 LS M47K, LO M47K, LY M47K Source: http://www.osram.convergy.de LUXEON: - LUMILED® LXK2-PW12-R00, LXK2-PW12-S00, LXK2-PW14-U00, LXK2-PW14-V00 LXK2-PM12-R00, LXK2-PM12-S00, LXK2-PM14-U00 LXK2-PE12-Q00, LXK2-PE12-R00, LXK2-PE12-S00, LXK2-PE14-T00, LXK2-PE14-U00 LXK2-PB12-K00, LXK2-PB12-L00, LXK2-PB12-M00, LXK2-PB14-N00, LXK2-PB14-P00, LXK2-PB14-Q00 LXK2-PR12-L00, LXK2-PR12-M00, LXK2-PR14-Q00, LXK2-PR14-R00 LXK2-PD12-Q00, LXK2-PD12-R00, LXK2-PD12-S00 LXK2-PH12-R00, LXK2-PH12-S00 LXK2-PL12-P00, LXK2-PL12-Q00, LXK2-PL12-R00 Source: www.luxeon.com KINGBRIGHT: KA-3528ASYC Source: www.kingbright.com
R1-R39 = rcl:R-US_: RESISTOR, American symbol; SPICEPREFIX: R
S3 S4 = 2MS1-T2-B4-M2-Q-E-S:2MS1-T2-B4-M2-Q-E-S: 2M SERIES SUBMINIATURE TOGGLE SWITCH Source: Datasheet <http://www.kyohritsu.jp/eclib/OTHER/CATALOG/SW/2mseries.pdf>; ARROW_PART_NUMBER: 2MS1-T2-B4-M2-Q-E-S; DESCRIPTION: 2M SERIES SUBMINIATURE TOGGLE SWITCH; HEIGHT: 19.56mm; MANUFACTURER_NAME: Cosland; MANUFACTURER_PART_NUMBER: 2MS1-T2-B4-M2-Q-E-S
S5-S37 = SamacSys_Parts:DHS904J: 4 Way Surface Mount DIP Switch SP-NO <https://componentsearchengine.com/Images/3/DHS904J.jpg> Source: Datasheet <http://docs-europe.electrocomponents.com/webdocs/0e2b/0900766b80e2b79f.pdf>; DESCRIPTION: 4 Way Surface Mount DIP Switch SP-NO; HEIGHT: mm; MANUFACTURER_NAME: KNITTER-SWITCH; MANUFACTURER_PART_NUMBER: DHS904J; RS_PART_NUMBER: 7023653; SUPPLIER_NAME: RS
S38 S39 = KSC341JLFS:KSC

## Net classes
0 default: width 0.203 mm, drill 0.203 mm, clearance 0.254 mm
1 Power: width 0.381 mm, drill 0.203 mm, clearance 0.254 mm